# Altium project PCB_Cloud_Controller.PrjPCB
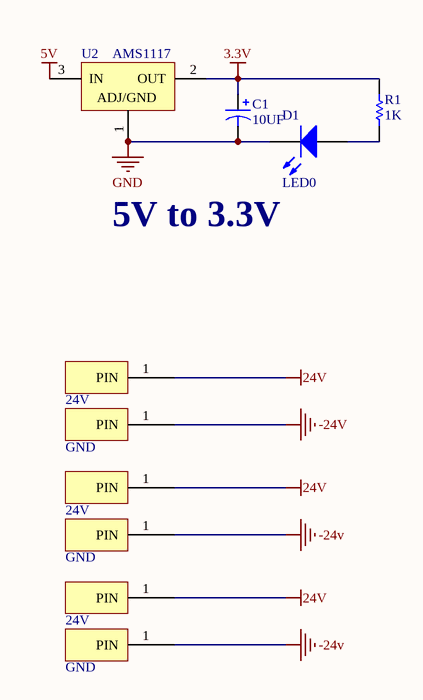
[diagram p0: POWER.SchDoc]
3 sheets, 46 parts. Net scope: global (net labels, ports and power ports of the same name join across sheets).
Board file: PCB_Cloud_Controller.PcbDoc
Sheets:
  POWER.SchDoc
  STM32f103RBT6.SchDoc
  interface.SchDoc

## Sheet POWER.SchDoc
size A4

### Parts
C1  10UF  [1812(4532)]
D1  LED0  [LED]
P10  24V  [KF508]
P11  GND  [KF508]
P12  24V  [KF508]
P13  GND  [KF508]
P14  24V  [KF508]
P15  GND  [KF508]
R1  1K  [0603(1608)]
U2  AMS1117  [SOT223-4M]

### Nets
3.3V: C1.1 R1.1 U2.2(OUT)
5V: U2.3(IN)
24V: P10.1(PIN) P12.1(PIN) P14.1(PIN)
-24V: P11.1(PIN) P13.1(PIN) P15.1(PIN)
GND: C1.2 D1.2(K) U2.1
NetD1_1: D1.1(A) R1.2

### Notes on the sheet
- 5V to 3.3V
- (in symbol AMS1117) ADJ/GND

### Library data of the parts
C1 = Cap Pol3: Polarized Capacitor (Surface Mount); Published: 8-Jun-2000; LatestRevisionDate: 29-May-2009; LatestRevisionNote: IPC-7351 Footprint Added.; PackageReference: C0805; Publisher: Altium Limited; Value: 10UF; PackageDescription: Chip Capacitor
D1 = LED0: Typical INFRARED GaAs LED; Published: 8-Jun-2000; LatestRevisionDate: 08-Jul-2005; LatestRevisionNote: Mech Layer 1 removed.; PackageReference: LED-0; Publisher: Altium Limited; PackageDescription: LED; 2 Leads
P10-P15 = KF508: Power Socket 20A
R1 = Res Semi: Semiconductor Resistor; Published: 8-Jun-2000; LatestRevisionDate: 17-Jul-2002; LatestRevisionNote: Re-released for DXP Platform.; PackageReference: AXIAL-0.5; Publisher: Altium Limited; Value: 1K
U2 = AMS1117: DC-DC Convertor 3.3V

## Sheet STM32f103RBT6.SchDoc
size A4
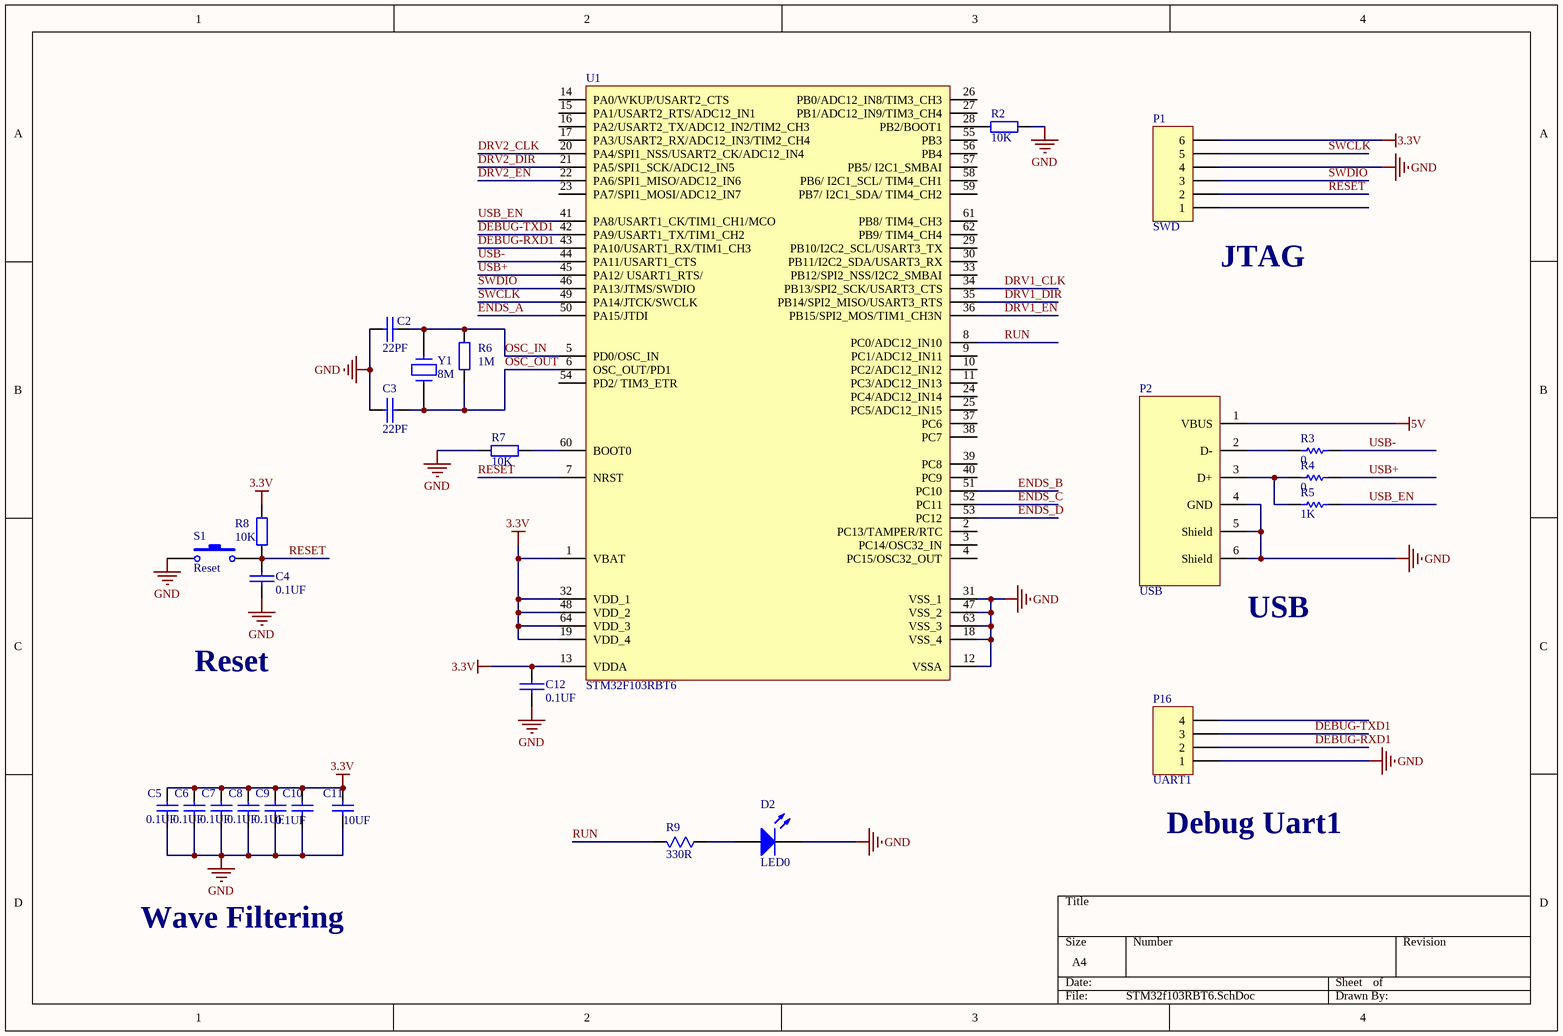
[diagram p1: STM32f103RBT6.SchDoc]

### Parts
C2  22PF  [0603(1608)]
C3  22PF  [0603(1608)]
C4  0.1UF  [0603(1608)]
C5  0.1UF  [0603(1608)]
C6  0.1UF  [0603(1608)]
C7  0.1UF  [0603(1608)]
C8  0.1UF  [0603(1608)]
C9  0.1UF  [0603(1608)]
C10  0.1UF  [0603(1608)]
C11  10UF  [0805(2012)]
C12  0.1UF  [0603(1608)]
D2  LED0  [LED]
P1  SWD  [HDR1X6]
P2  USB  [USB/SM0.8-6H5]
P16  UART1  [HDR1X4]
R2  10K  [0603(1608)]
R3  0  [0603(1608)]
R4  0  [0603(1608)]
R5  1K  [0603(1608)]
R6  1M  [0603(1608)]
R7  10K  [0603(1608)]
R8  10K  [0603(1608)]
R9  330R  [0603(1608)]
S1  Reset  [SW-6]
U1  STM32F103RBT6  [LQFP64_M]
Y1  8M  [BCY-W2/E4.7]

### Nets
3.3V: C5.1 C6.1 C7.1 C8.1 C9.1 C10.1 C11.1 C12.2 P1.6 R8.1 U1.1(VBAT) U1.13(VDDA) U1.19(VDD_4) U1.32(VDD_1) U1.48(VDD_2) U1.64(VDD_3)
5V: P2.1(VBUS)
GND: C2.1 C3.2 C4.1 C5.2 C6.2 C7.2 C8.2 C9.2 C10.2 C11.2 C12.1 D2.2(K) P1.4 P2.4(GND) P2.5(Shield) P2.6(Shield) P16.1 R2.2 R7.1 S1.1 U1.12(VSSA) U1.18(VSS_4) U1.31(VSS_1) U1.47(VSS_2) U1.63(VSS_3)
DEBUG-RXD1: P16.2 U1.43(PA10/USART1_RX/TIM1_CH3)
DEBUG-TXD1: P16.3 U1.42(PA9/USART1_TX/TIM1_CH2)
DRV1_CLK: U1.34(PB13/SPI2_SCK/USART3_CTS)
DRV1_DIR: U1.35(PB14/SPI2_MISO/USART3_RTS)
DRV1_EN: U1.36(PB15/SPI2_MOS/TIM1_CH3N)
DRV2_CLK: U1.20(PA4/SPI1_NSS/USART2_CK/ADC12_IN4)
DRV2_DIR: U1.21(PA5/SPI1_SCK/ADC12_IN5)
DRV2_EN: U1.22(PA6/SPI1_MISO/ADC12_IN6)
ENDS_A: U1.50(PA15/JTDI)
ENDS_B: U1.51(PC10)
ENDS_C: U1.52(PC11)
ENDS_D: U1.53(PC12)
OSC_IN: C2.2 R6.1 U1.5(PD0/OSC_IN) Y1.1
OSC_OUT: C3.1 R6.2 U1.6(OSC_OUT/PD1) Y1.2
RESET: C4.2 P1.2 R8.2 S1.2 U1.7(NRST)
RUN: R9.2 U1.8(PC0/ADC12_IN10)
SWCLK: P1.5 U1.49(PA14/JTCK/SWCLK)
SWDIO: P1.3 U1.46(PA13/JTMS/SWDIO)
USB+: R4.2 U1.45(PA12/_USART1_RTS/)
USB-: R3.2 U1.44(PA11/USART1_CTS)
USB_EN: R5.2 U1.41(PA8/USART1_CK/TIM1_CH1/MCO)
NetD2_1: D2.1(A) R9.1
NetP2_2: P2.2(D-) R3.1
NetP2_3: P2.3(D+) R4.1 R5.1
NetR2_1: R2.1 U1.28(PB2/BOOT1)
NetR7_2: R7.2 U1.60(BOOT0)

Not connected (* = marked no-connect by the designer): P1 1; P16 4; U1 2(PC13/TAMPER/RTC) 3(PC14/OSC32_IN) 4(PC15/OSC32_OUT) 9(PC1/ADC12_IN11) 10(PC2/ADC12_IN12) 11(PC3/ADC12_IN13) 14(PA0/WKUP/USART2_CTS) 15(PA1/USART2_RTS/ADC12_IN1) 16(PA2/USART2_TX/ADC12_IN2/TIM2_CH3) 17(PA3/USART2_RX/ADC12_IN3/TIM2_CH4) 23(PA7/SPI1_MOSI/ADC12_IN7) 24(PC4/ADC12_IN14) 25(PC5/ADC12_IN15) 26(PB0/ADC12_IN8/TIM3_CH3) 27(PB1/ADC12_IN9/TIM3_CH4) 29(PB10/I2C2_SCL/USART3_TX) 30(PB11/I2C2_SDA/USART3_RX) 33(PB12/SPI2_NSS/I2C2_SMBAI) 37(PC6) 38(PC7) 39(PC8) 40(PC9) 54(PD2/_TIM3_ETR) 55(PB3) 56(PB4) 57(PB5/_I2C1_SMBAI) 58(PB6/_I2C1_SCL/_TIM4_CH1) 59(PB7/_I2C1_SDA/_TIM4_CH2) 61(PB8/_TIM4_CH3) 62(PB9/_TIM4_CH4)

### Notes on the sheet
- (near P1) JTAG
- (near P2) USB
- Reset
- (near P16) Debug Uart1
- Wave Filtering

### Library data of the parts
C2-C4 C12 = CAP: Capacitor
C5-C11 = Cap: Capacitor; Published: 8-Jun-2000; LatestRevisionDate: 17-Jul-2002; LatestRevisionNote: Re-released for DXP Platform.; PackageReference: RAD-0.3; Publisher: Altium Limited
D2 = LED0: Typical INFRARED GaAs LED; Published: 8-Jun-2000; LatestRevisionDate: 08-Jul-2005; LatestRevisionNote: Mech Layer 1 removed.; PackageReference: LED-0; Publisher: Altium Limited; PackageDescription: LED; 2 Leads
P1 = Header 6: Header, 6-Pin; LatestRevisionDate: 17-Jul-2002; LatestRevisionNote: Re-released for DXP Platform.; Publisher: Altium Limited
P2 = Con Usb
P16 = Header 4: Header, 4-Pin; LatestRevisionDate: 17-Jul-2002; LatestRevisionNote: Re-released for DXP Platform.; Publisher: Altium Limited
R2 R6-R8 = Res2: Resistor
R3 R4 = Res Semi: Semiconductor Resistor; Value: 27; Published: 8-Jun-2000; LatestRevisionDate: 17-Jul-2002; LatestRevisionNote: Re-released for DXP Platform.; PackageReference: AXIAL-0.5; Publisher: Altium Limited
R5 = Res Semi: Semiconductor Resistor; Value: 1K5; Published: 8-Jun-2000; LatestRevisionDate: 17-Jul-2002; LatestRevisionNote: Re-released for DXP Platform.; PackageReference: AXIAL-0.5; Publisher: Altium Limited
R9 = RES
S1 = SW-PB: Switch; Published: 24-Mar-1999; LatestRevisionDate: 17-Jul-2002; LatestRevisionNote: Re-released for DXP Platform.; PackageReference: SPST-2; Publisher: Altium Limited; PackageDescription: Switch; 2 Leads
Y1 = CRYSTAL

## Sheet interface.SchDoc
size A4
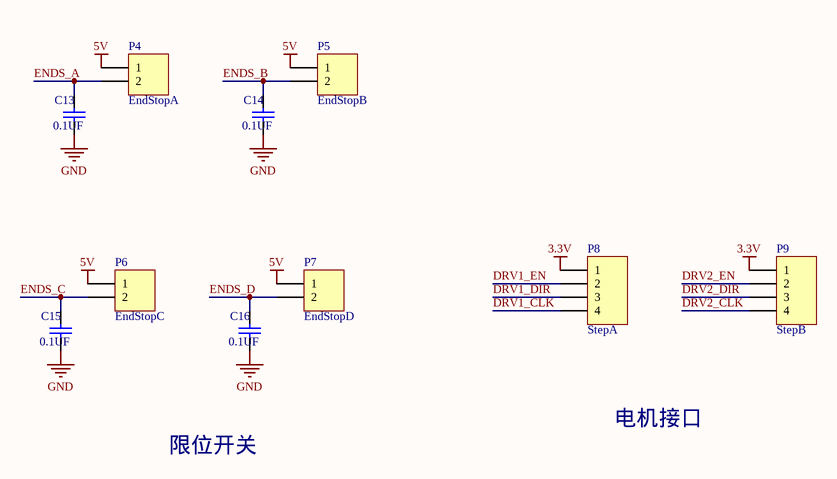
[diagram p2: interface.SchDoc]

### Parts
C13  0.1UF  [0603(1608)]
C14  0.1UF  [0603(1608)]
C15  0.1UF  [0603(1608)]
C16  0.1UF  [0603(1608)]
P4  EndStopA  [XH2.54_2PIN]
P5  EndStopB  [XH2.54_2PIN]
P6  EndStopC  [XH2.54_2PIN]
P7  EndStopD  [XH2.54_2PIN]
P8  StepA  [XH2.54_4PIN]
P9  StepB  [XH2.54_4PIN]

### Nets
3.3V: P8.1 P9.1
5V: P4.1 P5.1 P6.1 P7.1
GND: C13.2 C14.2 C15.2 C16.2
DRV1_CLK: P8.4
DRV1_DIR: P8.3
DRV1_EN: P8.2
DRV2_CLK: P9.4
DRV2_DIR: P9.3
DRV2_EN: P9.2
ENDS_A: C13.1 P4.2
ENDS_B: C14.1 P5.2
ENDS_C: C15.1 P6.2
ENDS_D: C16.1 P7.2

### Notes on the sheet
- 限位开关
- 电机接口

### Library data of the parts
C13-C16 = Cap: Capacitor; Published: 8-Jun-2000; LatestRevisionDate: 17-Jul-2002; LatestRevisionNote: Re-released for DXP Platform.; PackageReference: RAD-0.3; Publisher: Altium Limited
P4-P7 = Header 2: Header, 2-Pin; LatestRevisionDate: 17-Jul-2002; LatestRevisionNote: Re-released for DXP Platform.; Publisher: Altium Limited
P8 P9 = Header 4: Header, 4-Pin; LatestRevisionDate: 17-Jul-2002; LatestRevisionNote: Re-released for DXP Platform.; Publisher: Altium Limited

## Nets that join several sheets
3.3V: POWER (C1.1 R1.1 U2.2), STM32f103RBT6 (16 pins), interface (P8.1 P9.1)
5V: POWER (U2.3), STM32f103RBT6 (P2.1), interface (P4.1 P5.1 P6.1 P7.1)
GND: POWER (C1.2 D1.2 U2.1), STM32f103RBT6 (25 pins), interface (C13.2 C14.2 C15.2 C16.2)
DRV1_CLK: STM32f103RBT6 (U1.34), interface (P8.4)
DRV1_DIR: STM32f103RBT6 (U1.35), interface (P8.3)
DRV1_EN: STM32f103RBT6 (U1.36), interface (P8.2)
DRV2_CLK: STM32f103RBT6 (U1.20), interface (P9.4)
DRV2_DIR: STM32f103RBT6 (U1.21), interface (P9.3)
DRV2_EN: STM32f103RBT6 (U1.22), interface (P9.2)
ENDS_A: STM32f103RBT6 (U1.50), interface (C13.1 P4.2)
ENDS_B: STM32f103RBT6 (U1.51), interface (C14.1 P5.2)
ENDS_C: STM32f103RBT6 (U1.52), interface (C15.1 P6.2)
ENDS_D: STM32f103RBT6 (U1.53), interface (C16.1 P7.2)